# Altium schematic sheet tyre_temps.SchDoc
size A3; PageSetup: Record=PageOptions|CenterHorizontal=True|CenterVertical=True|PrintScale=1.00|XCorrection=1.00|YCorrection=1.00|PrintKind=1|BorderSize=5000000|LeftOffset=0|BottomOffset=0|Orientation=2|PaperLength=1000|PaperWidth=1000|Scale=100|PaperSource=7|PrintQuality=-3|MediaType=1|DitherType=10|PrintScaleMode=1|PaperKind=A3|PaperIndex=8
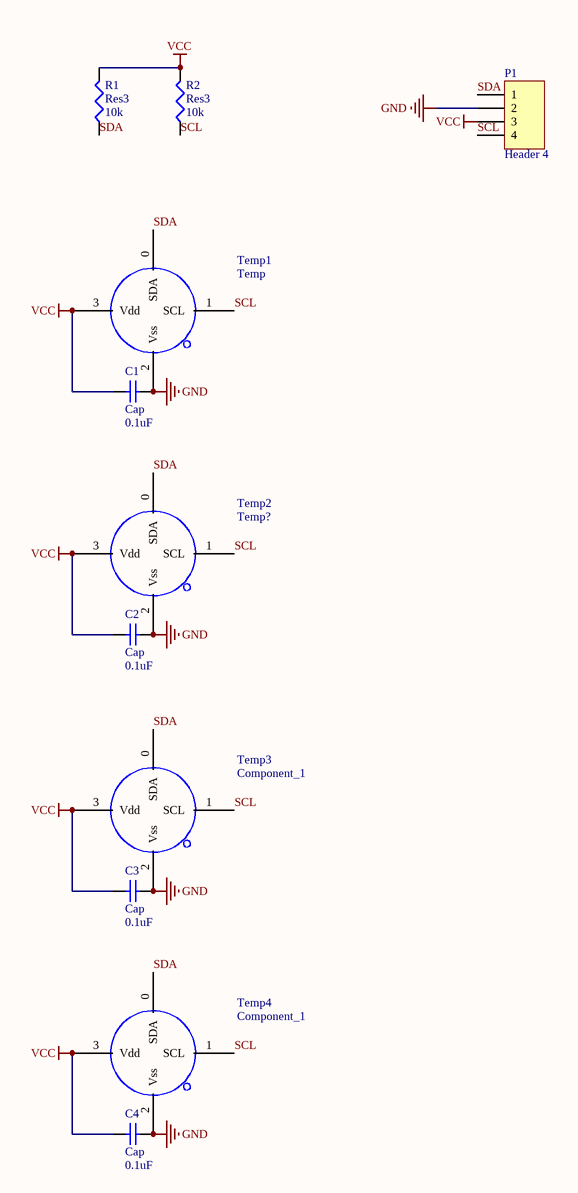
[diagram p0: tyre_temps.SchDoc]

## Parts
C1  Cap  value 0.1uF  [R0805]
C2  Cap  value 0.1uF  [R0805]
C3  Cap  value 0.1uF  [R0805]
C4  Cap  value 0.1uF  [R0805]
P1  Header 4  [HDR1X4]
R1  Res3  value 10k  [R0805]
R2  Res3  value 10k  [R0805]
Temp1  Temp  [MLX90614]
Temp2  Temp?  [MLX90614]
Temp3  Component_1  [MLX90614]
Temp4  Component_1  [MLX90614]

## Nets
GND: C1.2 C2.2 C3.2 C4.2 P1.2 Temp1.2(Vss) Temp2.2(Vss) Temp3.2(Vss) Temp4.2(Vss)
VCC: C1.1 C2.1 C3.1 C4.1 P1.3 R1.2 R2.2 Temp1.3(Vdd) Temp2.3(Vdd) Temp3.3(Vdd) Temp4.3(Vdd)
SCL: P1.4 R2.1 Temp1.1(SCL) Temp2.1(SCL) Temp3.1(SCL) Temp4.1(SCL)
SDA: P1.1 R1.1 Temp1.0(SDA) Temp2.0(SDA) Temp3.0(SDA) Temp4.0(SDA)

## Library data of the parts
C1-C4 = Cap: Capacitor; Published: 8-Jun-2000; LatestRevisionDate: 17-Jul-2002; LatestRevisionNote: Re-released for DXP Platform.; PackageReference: RAD-0.3; Publisher: Altium Limited; PackageDescription: Radial Cap, Thru-Hole; 2 Leads; 0.3 in Pin Spacing
P1 = Header 4: Header, 4-Pin; LatestRevisionDate: 17-Jul-2002; LatestRevisionNote: Re-released for DXP Platform.; Publisher: Altium Limited
R1 R2 = Res3: Resistor; Published: 8-Jun-2000; LatestRevisionDate: 29-May-2009; LatestRevisionNote: IPC-7351 Footprint Added.; PackageReference: J1-0603; Publisher: Altium Limited; PackageDescription: Chip Resistor